# Altium schematic sheet BADGE.SchDoc
size A3; CompanyName: KDS; Engineer: João Paulo Nogueira Bino; Organization: KDS; DocumentNumber: 0; Revision: V1I1; SheetNumber: 0; SheetTotal: 6; PageSetup: Record=PageOptions|CenterHorizontal=True|CenterVertical=True|PrintScale=1.07|XCorrection=1.00|YCorrection=1.00|PrintKind=1|BorderSize=5000000|LeftOffset=0|BottomOffset=0|Orientation=2|PaperLength=1000|PaperWidth=1000|Scale=100|PaperSource=7|PrintQuality=600|MediaType=1|DitherType=10|PaperKind=A3|PrintScaleMode=1; ProjectName: KDS C6A816x Module
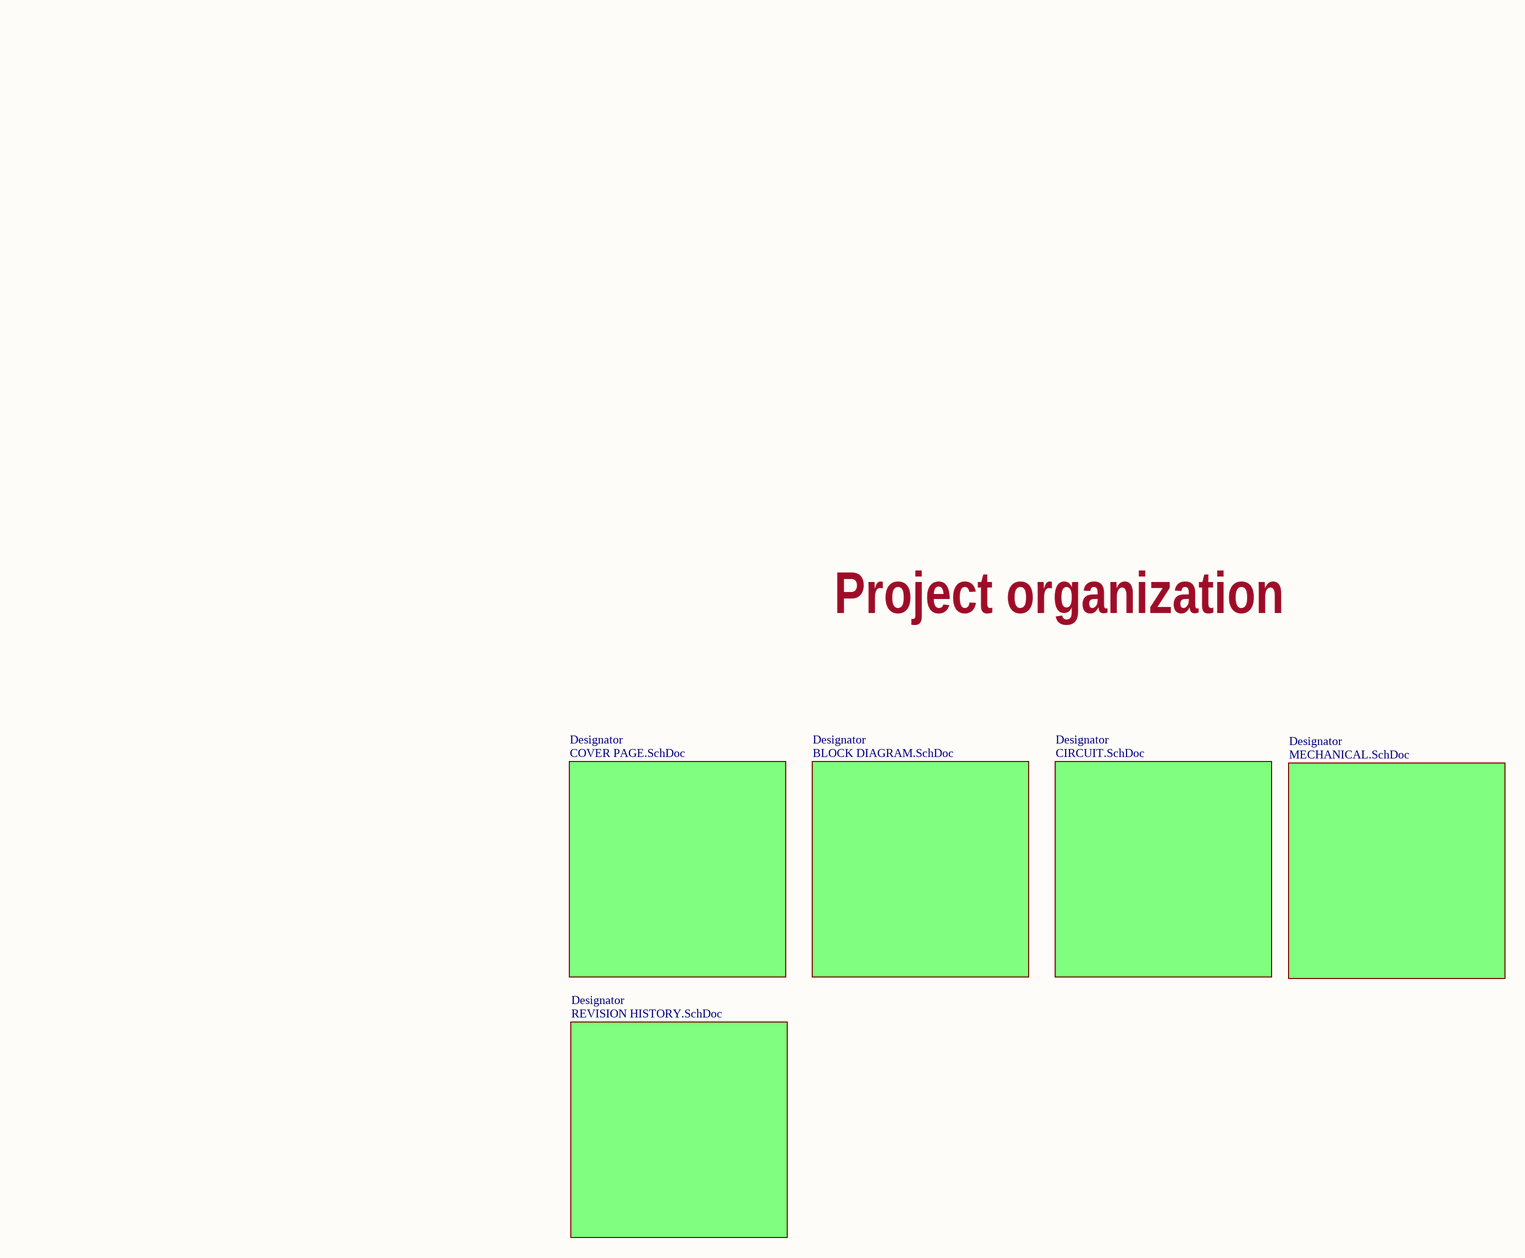
[diagram p0: BADGE.SchDoc]

## Sub-sheets
Designator = COVER PAGE.SchDoc: no entries
Designator = BLOCK DIAGRAM.SchDoc: no entries
Designator = CIRCUIT.SchDoc: no entries
Designator = MECHANICAL.SchDoc: no entries
Designator = REVISION HISTORY.SchDoc: no entries

## Notes on the sheet
- Project organization
- Project:
- Revision:
- Engineer:
- Title:
- Pag
- of
- Date:
- Hour:
- Variant:
- Embedded Things